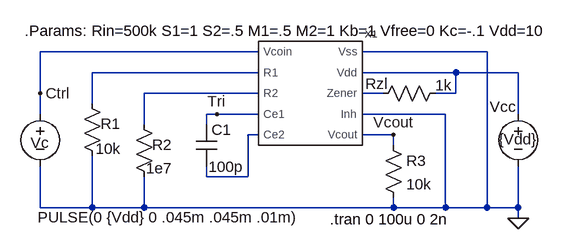
[diagram p0: schematic 4046VcoTest.asc]
4046VcoTest.asc, the LTspice schematic file:
Version 4
SHEET 1 880 680
WIRE -288 256 -288 192
WIRE -288 288 -288 256
WIRE -288 432 -288 368
WIRE -208 272 -208 224
WIRE -208 432 -288 432
WIRE -208 432 -208 352
WIRE -128 304 -128 256
WIRE -128 432 -208 432
WIRE -128 432 -128 384
WIRE -32 304 -32 288
WIRE -32 384 -32 368
WIRE -16 288 -32 288
WIRE 32 384 -32 384
WIRE 32 384 32 320
WIRE 48 192 -288 192
WIRE 48 224 -208 224
WIRE 48 256 -128 256
WIRE 48 288 -16 288
WIRE 48 320 32 320
WIRE 240 256 208 256
WIRE 256 320 208 320
WIRE 256 336 256 320
WIRE 256 432 -128 432
WIRE 256 432 256 416
WIRE 336 288 208 288
WIRE 336 432 256 432
WIRE 336 432 336 288
WIRE 352 224 208 224
WIRE 352 256 320 256
WIRE 352 256 352 224
WIRE 400 192 208 192
WIRE 400 432 336 432
WIRE 400 432 400 192
WIRE 448 224 352 224
WIRE 448 288 448 224
WIRE 448 432 400 432
WIRE 448 432 448 368
WIRE 448 448 448 432
FLAG 448 448 0
FLAG 256 320 Vcout
FLAG -288 256 Ctrl
FLAG -16 288 Tri
SYMBOL voltage 448 272 R0
WINDOW 0 -44 5 Left 0
WINDOW 3 -30 55 Left 0
WINDOW 123 0 0 Left 0
WINDOW 39 0 0 Left 0
SYMATTR InstName Vcc
SYMATTR Value {Vdd}
SYMBOL res -224 256 R0
WINDOW 0 29 47 Left 0
WINDOW 3 21 85 Left 0
SYMATTR InstName R1
SYMATTR Value 10k
SYMBOL res -144 288 R0
WINDOW 0 28 47 Left 0
WINDOW 3 19 83 Left 0
SYMATTR InstName R2
SYMATTR Value 1e7
SYMBOL res 336 240 R90
WINDOW 0 17 106 VBottom 0
WINDOW 3 -12 3 VTop 0
SYMATTR InstName Rzl
SYMATTR Value 1k
SYMBOL cap -48 304 R0
WINDOW 3 19 65 Left 0
SYMATTR Value 100p
SYMATTR InstName C1
SYMBOL res 240 320 R0
SYMATTR InstName R3
SYMATTR Value 10k
SYMBOL voltage -288 272 R0
WINDOW 0 -15 60 Left 0
WINDOW 3 -4 175 Left 0
WINDOW 123 0 0 Left 0
WINDOW 39 0 0 Left 0
SYMATTR InstName Vc
SYMATTR Value PULSE(0 {Vdd} 0 .045m .045m .01m)
SYMBOL Vco4046 128 256 R0
SYMATTR InstName X1
TEXT 158 450 Left 0 !.tran 0 100u 0 2n
TEXT -312 160 Left 0 !.Params: Rin=500k S1=1 S2=.5 M1=.5 M2=1 Kb=1 Vfree=0 Kc=-.1 Vdd=10

The netlist it stands for:
* 4046VcoTest.asc
Vcc N005 0 {Vdd}
R1 N001 0 10k
R2 N002 0 1e7
Rzl N005 N004 1k
C1 Tri N003 100p
R3 Vcout 0 10k
Vc Ctrl 0 PULSE(0 {Vdd} 0 .045m .045m .01m)
XX1 Ctrl N001 N002 Tri N003 Vcout 0 N004 N005 0 4046Vco  ; pins Vcoin R1 R2 Ce1 Ce2 Vcout Inh Zener Vdd Vss
.tran 0 100u 0 2n
.Params: Rin=500k S1=1 S2=.5 M1=.5 M2=1 Kb=1 Vfree=0 Kc=-.1 Vdd=10
.lib Vco4046.sub
.backanno
.end